# Altium schematic sheet Preamp.SchDoc
size A
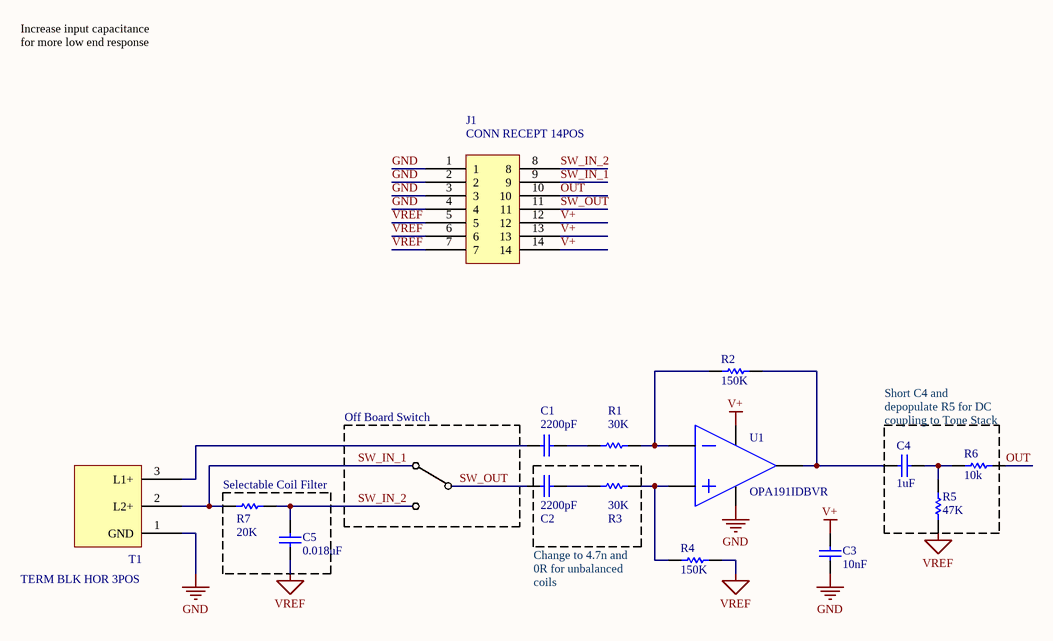
[diagram p0: Preamp.SchDoc]

## Parts
C1  2200pF  [CAPC1608X09N]
C2  2200pF  [CAPC1608X09N]
C3  10nF  [CAPC1608X09N]
C4  1uF  [CAPC1608X09N]
C5  0.018uF  [CAPC1608X09N]
J1  CONN RECEPT 14POS  [DF12(3.0)-14DS]
R1  30K  [RESC1608X06N]
R2  150K  [RESC1608X06N]
R3  30K  [RESC1608X06N]
R4  150K  [RESC1608X06N]
R5  47K  [RESC1608X06N]
R6  10k  [RESC1608X06N]
R7  20K  [RESC1608X06N]
T1  TERM BLK HOR 3POS  [TERM BLK HOR 3POS]
U1  OPA191IDBVR  [SOT23-5]

## Blocks framed on the sheet
Selectable Coil Filter: C5 R7

## Nets
GND: C3.1 J1.1 J1.2 J1.3 J1.4 T1.1(GND) U1.2(GND)
V+: C3.2 J1.12 J1.13 J1.14 U1.5(V+)
VREF: C5.1 J1.5 J1.6 J1.7 R4.2 R5.1
OUT: J1.10 R6.1
SW_IN_1: J1.9 R7.1 T1.2(L2+)
SW_IN_2: C5.2 J1.8 R7.2
SW_OUT: C2.1 J1.11
NetC1_1: C1.1 T1.3(L1+)
NetC1_2: C1.2 R1.1
NetC2_2: C2.2 R3.1
NetC4_1: C4.1 R2.2 U1.1(VOUT)
NetC4_2: C4.2 R5.2 R6.2
NetR1_2: R1.2 R2.1 U1.4(VIN-)
NetR3_2: R3.2 R4.1 U1.3(VIN+)

## Notes on the sheet
- Increase input capacitance for more low end response
- Off Board Switch
- Short C4 and depopulate R5 for DC coupling to Tone Stack
- Change to 4.7n and 0R for unbalanced coils

## Library data of the parts
C1 C2 = CAP CER 2200PF 50V C0G/NP0 0603: 2200pF ±1% 50V Ceramic Capacitor C0G, NP0 0603 (1608 Metric); Manufacturer: Murata; Value: 2200pF; Digikey Part Number: 490-7768-1-ND; Voltage: 50V; Tolerance: 1%; Rating: C0G
C3 = CAP CER 10000PF 50V C0G/NP0 0603: 10000pF ±5% 50V Ceramic Capacitor C0G, NP0 0603 (1608 Metric); Manufacturer: Murata; Value: 10nF; Digikey Part Number: 490-9666-1-ND; Rating: C0G
C4 = CAP CER 1UF 25V X7R 0603: 1µF ±10% 25V Ceramic Capacitor X7R 0603 (1608 Metric); Value: 1uF; Rating: X7R; Digikey Part Number: 490-10673-1-ND; Package: 0603; Voltage: 25V; Tolerance: 10%
C5 = CAP CER 0.018UF 35V NP0 0603: Tolerance: 5%; Value: 0.018uF; Digikey Part Number: 445-174558-1-ND; Package: 0603; Voltage: 35V; Rating: NP0
J1 = DF12(3.0)-14DS-0.5V(86): 14 Position Connector Receptacle, Center Strip Contacts Surface Mount Gold; Manufacturer: Hirose; Digikey Part Number: H11702CT-ND
R1 R3 = RES SMD 30K OHM 1% 1/10W 0603: Type: RES; Footprint: 0603; Tolerance: 1%; Digikey Part Number: 311-30.0KHRCT-ND; Value: 30K
R2 R4 = RES SMD 150K OHM 1% 1/10W 0603: Type: RES; Footprint: 0603; Tolerance: 1%; Value: 150K; Digikey Part Number: 311-150KHRCT-ND
R5 = RES SMD 47K OHM 1% 1/10W 0603: RES 47K 0603; Tolerance: 1%; Type: RES; Footprint: 0603; Digikey Part Number: 311-47.0KHRCT-ND; Value: 47K
R6 = RES SMD 10K OHM 1% 1/10W 0603: Manufacturer: Yageo; Manufacturer Part Number: RC0603FR-0710KL; Power: 0.1W; Type: RES; Footprint: 0603; Tolerance: 1%; Digikey Part Number: 311-10.0KHRCT-ND; Value: 10k; Temperature: 155dC
R7 = RES SMD 20K OHM 1% 1/10W 0603: Type: RES; Footprint: 0603; Tolerance: 1%; Value: 20K; Digikey Part Number: 311-20.0KHRCT-ND
T1 = TERM BLK HOR 3POS: 3 Position Wire to Board Terminal Block Horizontal with Board 0.100" (2.54mm) Surface Mount; Digikey Part Number: 1195-3657-1-ND
U1 = OPA191IDBVR: General Purpose Amplifier 1 Circuit Rail-to-Rail SOT-23-5; Digikey Part Number: 296-44386-1-ND; Package: SOT-23-5